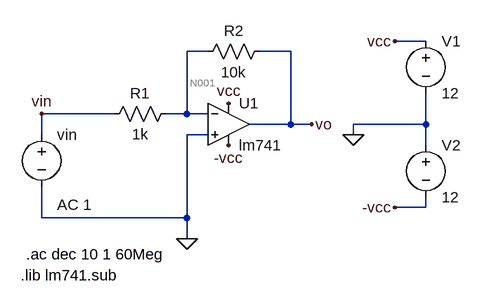
[diagram p0: schematic BODEOPAMP.asc]
BODEOPAMP.asc, the LTspice schematic file:
Version 4
SHEET 1 1112 680
WIRE 480 32 432 32
WIRE 144 48 112 48
WIRE 272 48 224 48
WIRE 0 144 -112 144
WIRE 112 144 112 48
WIRE 112 144 80 144
WIRE 144 144 112 144
WIRE 272 160 272 48
WIRE 272 160 208 160
WIRE 304 160 272 160
WIRE 480 160 480 112
WIRE 480 160 368 160
WIRE -112 176 -112 144
WIRE 144 176 112 176
WIRE 368 176 368 160
WIRE 480 192 480 160
WIRE 480 288 480 272
WIRE 480 288 432 288
WIRE -112 304 -112 256
WIRE 112 304 112 176
WIRE 112 304 -112 304
WIRE 112 336 112 304
FLAG 368 176 0
FLAG 432 32 vcc
FLAG 432 288 -vcc
FLAG 176 192 -vcc
FLAG 176 128 vcc
FLAG 112 336 0
FLAG 304 160 vo
FLAG -112 144 vin
SYMBOL res 96 128 R90
WINDOW 0 0 56 VBottom 2
WINDOW 3 32 56 VTop 2
SYMATTR InstName R1
SYMATTR Value 1k
SYMBOL res 240 32 R90
WINDOW 0 0 56 VBottom 2
WINDOW 3 32 56 VTop 2
SYMATTR InstName R2
SYMATTR Value 10k
SYMBOL voltage 480 16 R0
SYMATTR InstName V1
SYMATTR Value 12
SYMBOL voltage 480 176 R0
SYMATTR InstName V2
SYMATTR Value 12
SYMBOL voltage -112 160 R0
WINDOW 123 24 124 Left 2
WINDOW 39 0 0 Left 0
WINDOW 3 24 44 Left 2
SYMATTR Value2 AC 1
SYMATTR Value ""
SYMATTR InstName vin
SYMBOL OpAmps\\opamp2 176 96 R0
SYMATTR InstName U1
SYMATTR Value lm741
TEXT -144 392 Left 2 !.lib lm741.sub
TEXT -136 360 Left 2 !.ac dec 10 1 60Meg

The netlist it stands for:
* BODEOPAMP.asc
R1 N001 vin 1k
R2 vo N001 10k
V1 vcc 0 12
V2 0 -vcc 12
vin vin 0 AC 1
XU1 0 N001 vcc -vcc vo lm741  ; pins In+ In- V+ V- OUT
.lib lm741.sub
.ac dec 10 1 60Meg
.backanno
.end

* Results of the author's LTspice run, read from the files saved beside the schematic
* Operating Point, zero values left out:
*   V(n001) = 2 mV
*   V(vo) = 23 mV
*   V(vcc) = 12 V
*   V(-vcc) = -12 V
*   I(R1) = 2 µA
*   I(R2) = 2.1 µA
*   I(V1) = -1.627 mA
*   I(V2) = -1.625 mA
*   I(Vin) = 2 µA
*   Ix(u1:1) = 59.86 nA
*   Ix(u1:2) = 99.86 nA
*   Ix(u1:99) = 1.627 mA
*   Ix(u1:50) = -1.625 mA
*   Ix(u1:28) = -2.1 µA
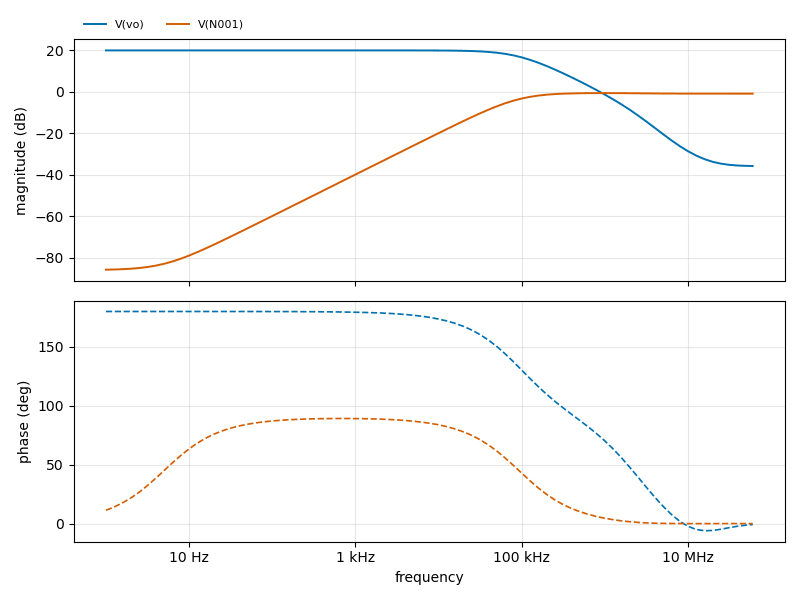
[diagram p1: AC Analysis of BODEOPAMP.asc, plotted from the saved traces]
* AC Analysis, 1 run:
*   V(vo): 20.00 dB at 1 Hz, -35.72 dB at 60 MHz, peak 20.00 dB at 1 Hz, 3 dB below the peak at 92.16 kHz
*   V(N001): -85.70 dB at 1 Hz, -0.84 dB at 60 MHz, peak -0.58 dB at 1 MHz, 3 dB below the peak at 91.62 kHz